# Altium schematic sheet 2002_PIC32.SchDoc
size A3; Author: Joao Marques Chaves; Organization: ETML-ES; Address1: Avenue Recordon 1; Address2: 1004 Lausanne; Address3: Switzerland; SheetNumber: 4; SheetTotal: 7; Version: C
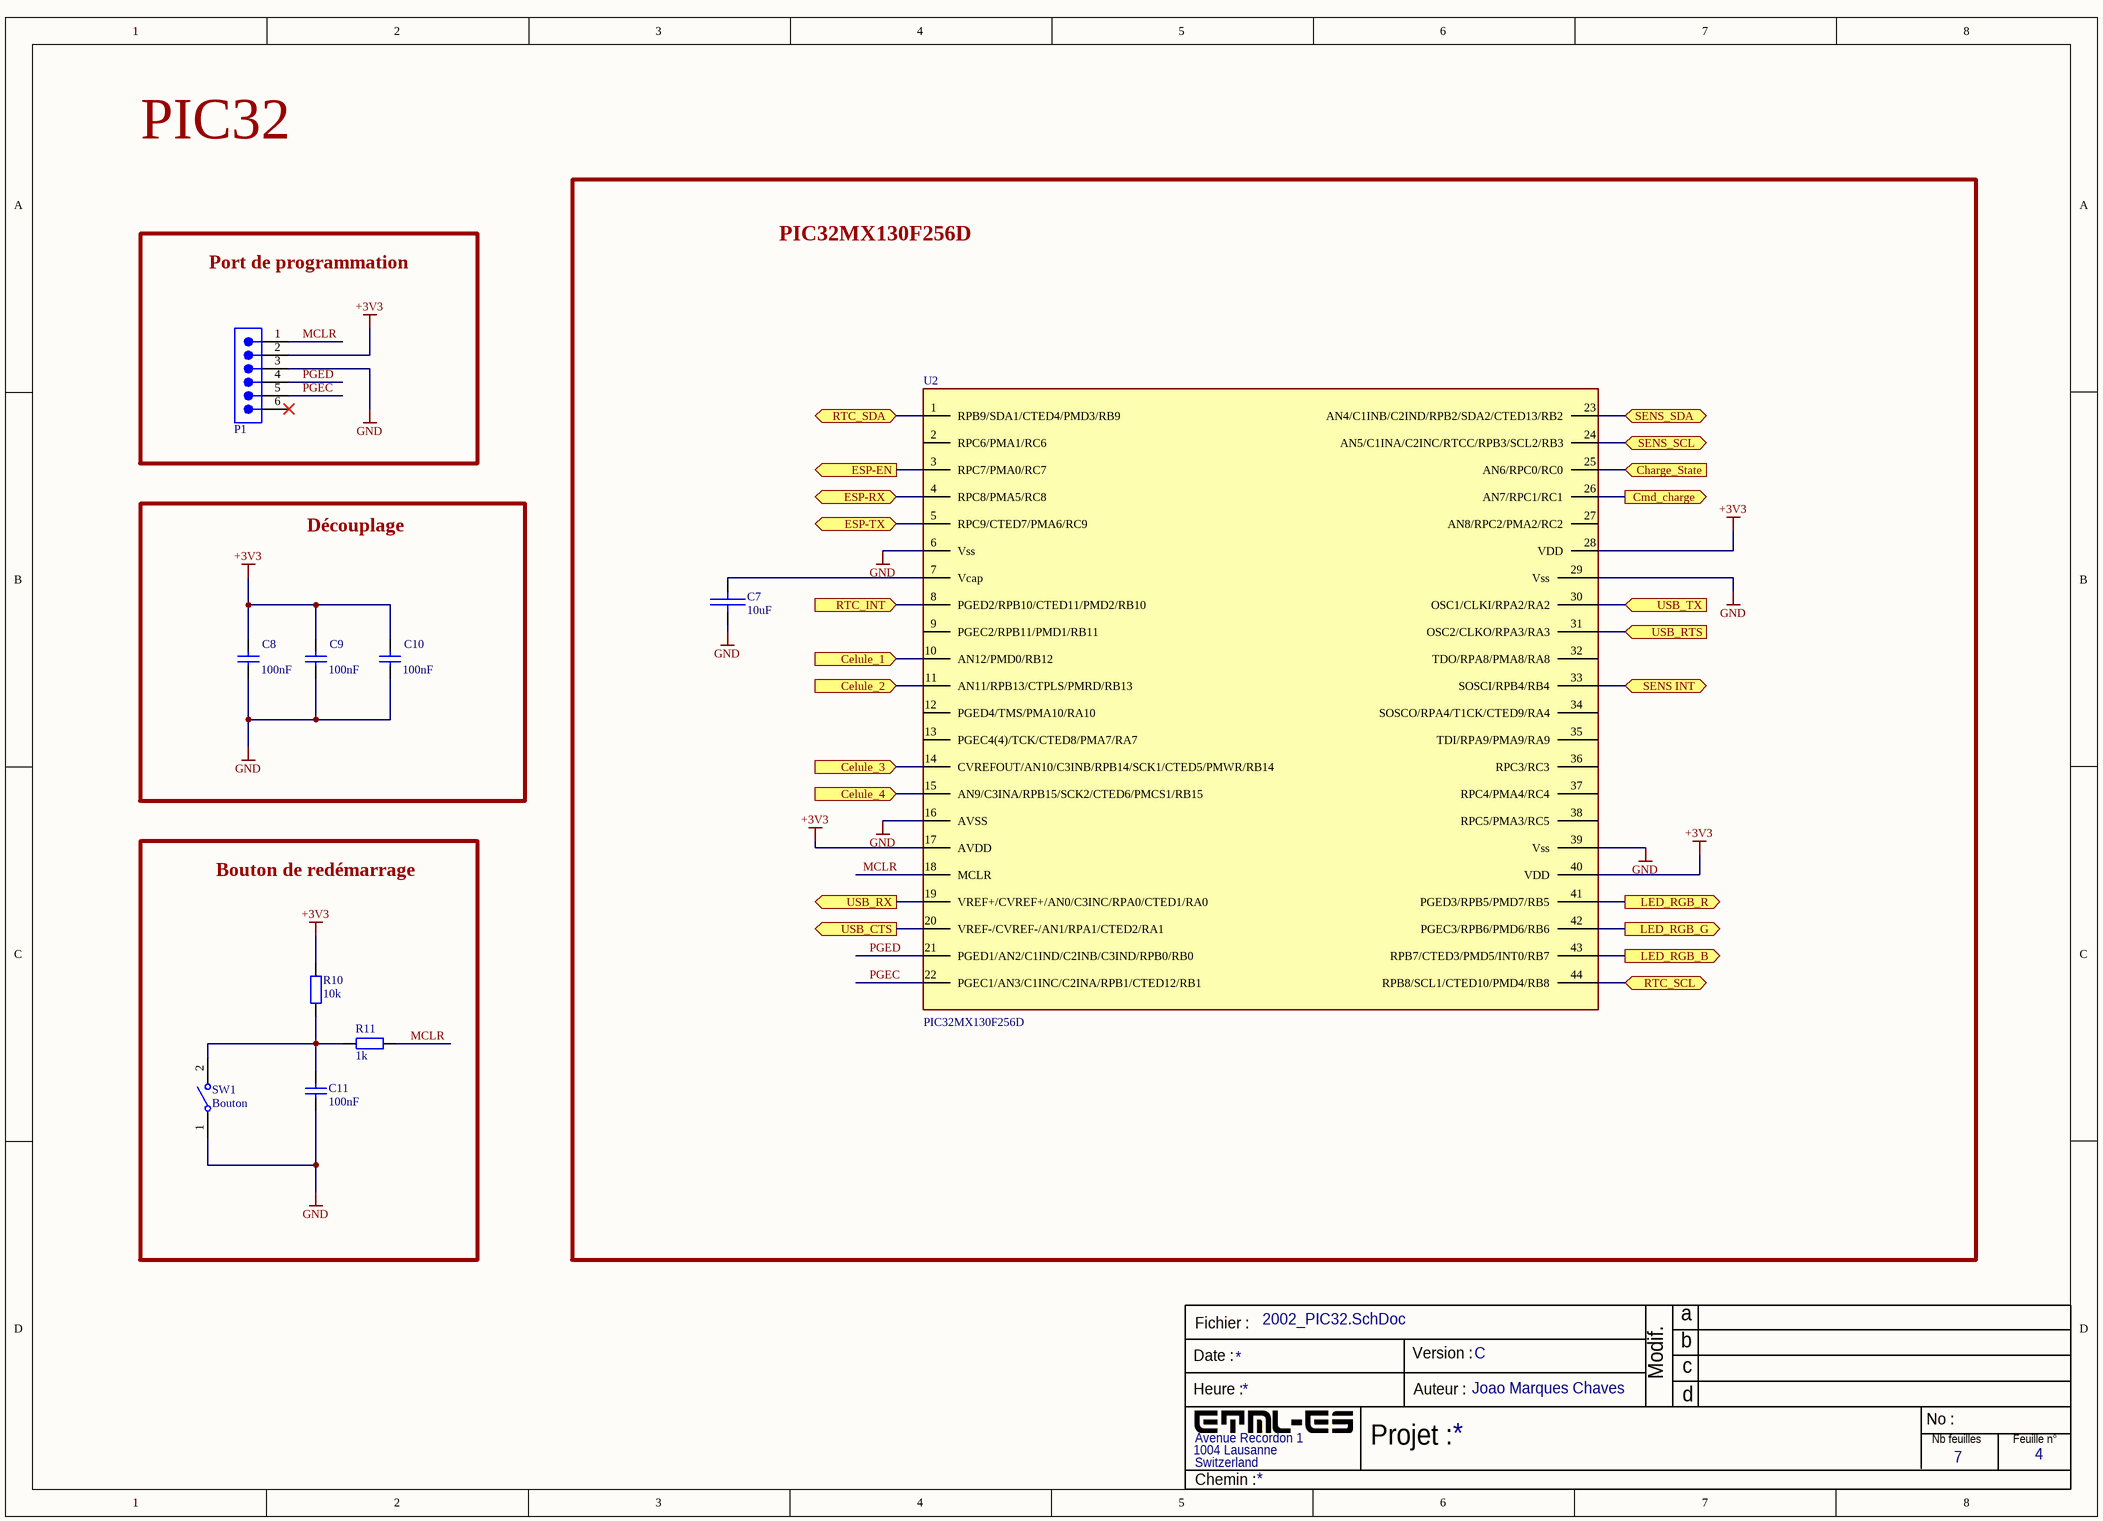
[diagram p0: 2002_PIC32.SchDoc]

## Parts
C7  10uF  [0805]
C8  100nF  [0805]
C9  100nF  [0805]
C10  100nF  [0805]
C11  100nF  [0805]
P1  6 Pin header  [conecteur 1x6]  (value not drawn)
R10  10k  [0805]
R11  1k  [0805]
SW1  Bouton  [Switch]
U2  PIC32MX130F256D  [PIC32MX130F256D-I/PT]

## Blocks framed on the sheet
PIC32MX130F256D: C7 U2
Port de programmation: P1
Découplage: C8-C10
Bouton de redémarrage: C11 R10 R11 SW1

## Ports
Celule_1 (in), Celule_2 (in), Celule_3 (in), Celule_4 (in), Charge_State (in), Cmd_charge (out), ESP-EN (out), ESP-RX (bidir), ESP-TX (bidir), LED_RGB_B (out), LED_RGB_G (out), LED_RGB_R (out), RTC_INT (in), RTC_SCL (bidir), RTC_SDA (bidir), SENS INT (bidir), SENS_SCL (bidir), SENS_SDA (bidir), USB_CTS (out), USB_RTS (in), USB_RX (out), USB_TX (in)

## Nets
+3V3: C8.2 C9.2 C10.2 P1.2 R10.1 U2.17(AVDD) U2.28(VDD) U2.40(VDD)
GND: C7.2 C8.1 C9.1 C10.1 C11.2 P1.3 SW1.1 U2.6(Vss) U2.16(AVSS) U2.29(Vss) U2.39(Vss)
Celule_1: U2.10(AN12/PMD0/RB12) ; port Celule_1
Celule_2: U2.11(AN11/RPB13/CTPLS/PMRD/RB13) ; port Celule_2
Celule_3: U2.14(CVREFOUT/AN10/C3INB/RPB14/SCK1/CTED5/PMWR/RB14) ; port Celule_3
Celule_4: U2.15(AN9/C3INA/RPB15/SCK2/CTED6/PMCS1/RB15) ; port Celule_4
Charge_State: U2.25(AN6/RPC0/RC0) ; port Charge_State
Cmd_charge: U2.26(AN7/RPC1/RC1) ; port Cmd_charge
ESP-EN: U2.3(RPC7/PMA0/RC7) ; port ESP-EN
ESP-RX: U2.4(RPC8/PMA5/RC8) ; port ESP-RX
ESP-TX: U2.5(RPC9/CTED7/PMA6/RC9) ; port ESP-TX
LED_RGB_B: U2.43(RPB7/CTED3/PMD5/INT0/RB7) ; port LED_RGB_B
LED_RGB_G: U2.42(PGEC3/RPB6/PMD6/RB6) ; port LED_RGB_G
LED_RGB_R: U2.41(PGED3/RPB5/PMD7/RB5) ; port LED_RGB_R
MCLR: P1.1 R11.2 U2.18(MCLR)
PGEC: P1.5 U2.22(PGEC1/AN3/C1INC/C2INA/RPB1/CTED12/RB1)
PGED: P1.4 U2.21(PGED1/AN2/C1IND/C2INB/C3IND/RPB0/RB0)
RTC_INT: U2.8(PGED2/RPB10/CTED11/PMD2/RB10) ; port RTC_INT
RTC_SCL: U2.44(RPB8/SCL1/CTED10/PMD4/RB8) ; port RTC_SCL
RTC_SDA: U2.1(RPB9/SDA1/CTED4/PMD3/RB9) ; port RTC_SDA
SENS INT: U2.33(SOSCI/RPB4/RB4) ; port SENS INT
SENS_SCL: U2.24(AN5/C1INA/C2INC/RTCC/RPB3/SCL2/RB3) ; port SENS_SCL
SENS_SDA: U2.23(AN4/C1INB/C2IND/RPB2/SDA2/CTED13/RB2) ; port SENS_SDA
USB_CTS: U2.20(VREF-/CVREF-/AN1/RPA1/CTED2/RA1) ; port USB_CTS
USB_RTS: U2.31(OSC2/CLKO/RPA3/RA3) ; port USB_RTS
USB_RX: U2.19(VREF+/CVREF+/AN0/C3INC/RPA0/CTED1/RA0) ; port USB_RX
USB_TX: U2.30(OSC1/CLKI/RPA2/RA2) ; port USB_TX
NetC7_1: C7.1 U2.7(Vcap)
NetC11_1: C11.1 R10.2 R11.1 SW1.2

Not connected (* = marked no-connect by the designer): P1 6*; U2 2(RPC6/PMA1/RC6) 9(PGEC2/RPB11/PMD1/RB11) 12(PGED4/TMS/PMA10/RA10) 13(PGEC4(4)/TCK/CTED8/PMA7/RA7) 27(AN8/RPC2/PMA2/RC2) 32(TDO/RPA8/PMA8/RA8) 34(SOSCO/RPA4/T1CK/CTED9/RA4) 35(TDI/RPA9/PMA9/RA9) 36(RPC3/RC3) 37(RPC4/PMA4/RC4) 38(RPC5/PMA3/RC5)

## Notes on the sheet
- PIC32
- Fichier :
- a
- Date :
- Heure :
- Version :
- Auteur :
- Modif.
- b
- c
- d
- Projet :
- No :
- Nb feuilles
- Feuille n°
- Chemin :

## Library data of the parts
C7 = Condensator: 0805 Condensator; Value: 10uF
C8-C11 = 885012207016: Capacitor smd; Manufacturer: Wurth Elektronik; Match Code: WCAP-CSGP; Capacitance Tolerance: +/-10%; Ceramic Type: X7R; Dissipation Factor: 5%; Insulation Resistance: 5GΩ; Rated Voltage (DC): 10V; Technical Reference: X7R0805104K010DFCT10000; Manufacturer Part Number: 885012207016; Category: Multilayer Ceramic Chip Capacitors; ComponentLink1Description: Website Link; ComponentLink1URL: https://www.we-online.com/redexpert/article/885012207016?ad; ComponentLink2Description: Datasheet Link; ComponentLink2URL: https://www.we-online.com/redexpert/spec/885012207016?ad; Mount: Surface Mount; Operating Temperature Max: 125°C; Operating Temperature Min: -55°C; Packaging: Tape and Reel; Case/Size Code: 0805; Length: 2mm; Width: 1.25mm; Height: 0.8mm; Capacitance: 100nF
P1 = 61300611121: WR-PHD Pin Header, THT, Vertical, pitch 2.54mm, 1 Row, 6P; Manufacturer: Wurth Elektronik; Contact Resistance: 20mΩ; Rated Current: 3A; Working Voltage: 250V; Withstanding Voltage: 500V; ComponentLink1Description: Website Link; ComponentLink1URL: https://www.we-online.com/redexpert/article/61300611121?ad; ComponentLink2Description: Datasheet Link; ComponentLink2URL: https://www.we-online.com/redexpert/spec/61300611121?ad; Manufacturer Part Number: 61300611121; Category: Board-to-Board Connectors; Match Code: WR-PHD; Mount: Through Hole; Operating Temperature Max: 105°C; Operating Temperature Min: -40°C; Packaging: Bag; Gender: Pin Header; Number of Pins: 6; Number of Rows: 1; Orientation: Vertical; Pitch: 2.54mm; ComponentLink3Description: distributeur; ComponentLink3URL: https://eu.mouser.com/ProductDetail/Wurth-Elektronik/61300611121?qs=t4813l51qx%2FRpdf0Kp1HlQ%3D%3D; ComponentLink4Description: Datasheet; ComponentLink4URL: https://www.we-online.com/components/products/datasheet/61300611121.pdf
R10 R11 = RES-0805: SMD Resistor
  R10: Resistance: 10k
  R11: Resistance: 1k
SW1 = 434121050836: Tactile Switches WS-TASV Tact Switch; Manufacturer: Wurth Elektronik; Circuit: SPST-NO; Operation Force: 360g; Rated Current: 50mA; Rated Voltage (DC): 12V; Washable: No; Manufacturer Part Number: 434121050836; Category: Tact Switches; Match Code: WS-TASV; ComponentLink1Description: Website Link; ComponentLink1URL: https://www.we-online.com/redexpert/article/434121050836?ad; ComponentLink2Description: Datasheet Link; ComponentLink2URL: https://www.we-online.com/redexpert/spec/434121050836?ad; Mount: Surface Mount; Operating Temperature Max: 85°C; Operating Temperature Min: -40°C; Packaging: Tape and Reel; Length: 6mm; Width: 3.5mm; Height: 5mm; Contact Material: Stainless Steel; Contact Plating: Silver; Terminal Material: Copper Alloy; Terminal Plating: Silver; ComponentLink3Description: distributeur; ComponentLink3URL: https://eu.mouser.com/ProductDetail/Wurth-Elektronik/434121050836?qs=wr8lucFkNMVxMSmJWja3%2Fg%3D%3D; ComponentLink4Description: Datasheet; ComponentLink4URL: https://www.we-online.com/components/products/datasheet/434121050836.pdf
U2 = PIC32MX130F256B-I_SS: Integrated Circuit; Manufacturer_Name: Microchip; Manufacturer_Part_Number: PIC32MX130F256D-50I/PT; Datasheet: https://www.mouser.ch/datasheet/2/268/PIC32MX1XX2XX283644_PIN_Datasheet_DS60001168L-3443206.pdf; Height: 2mm; Mouser Part Number: 579-MX130F256D50IPT; Mouser Price/Stock: https://www.mouser.com/Search/Refine.aspx?Keyword=579-MX130F256BISS; RS Part Number: 8806720P; RS Price/Stock: http://uk.rs-online.com/web/p/products/8806720P; ComponentLink1Description: distributeur; ComponentLink1URL: https://eu.mouser.com/ProductDetail/Microchip-Technology/PIC32MX130F256D-50I-PT?qs=XR%2FfMt4sL%252BEAZuPDxF6NKQ%3D%3D